# EAGLE schematic IoTKitV3-F429ZI (EAGLE 9.2.0)
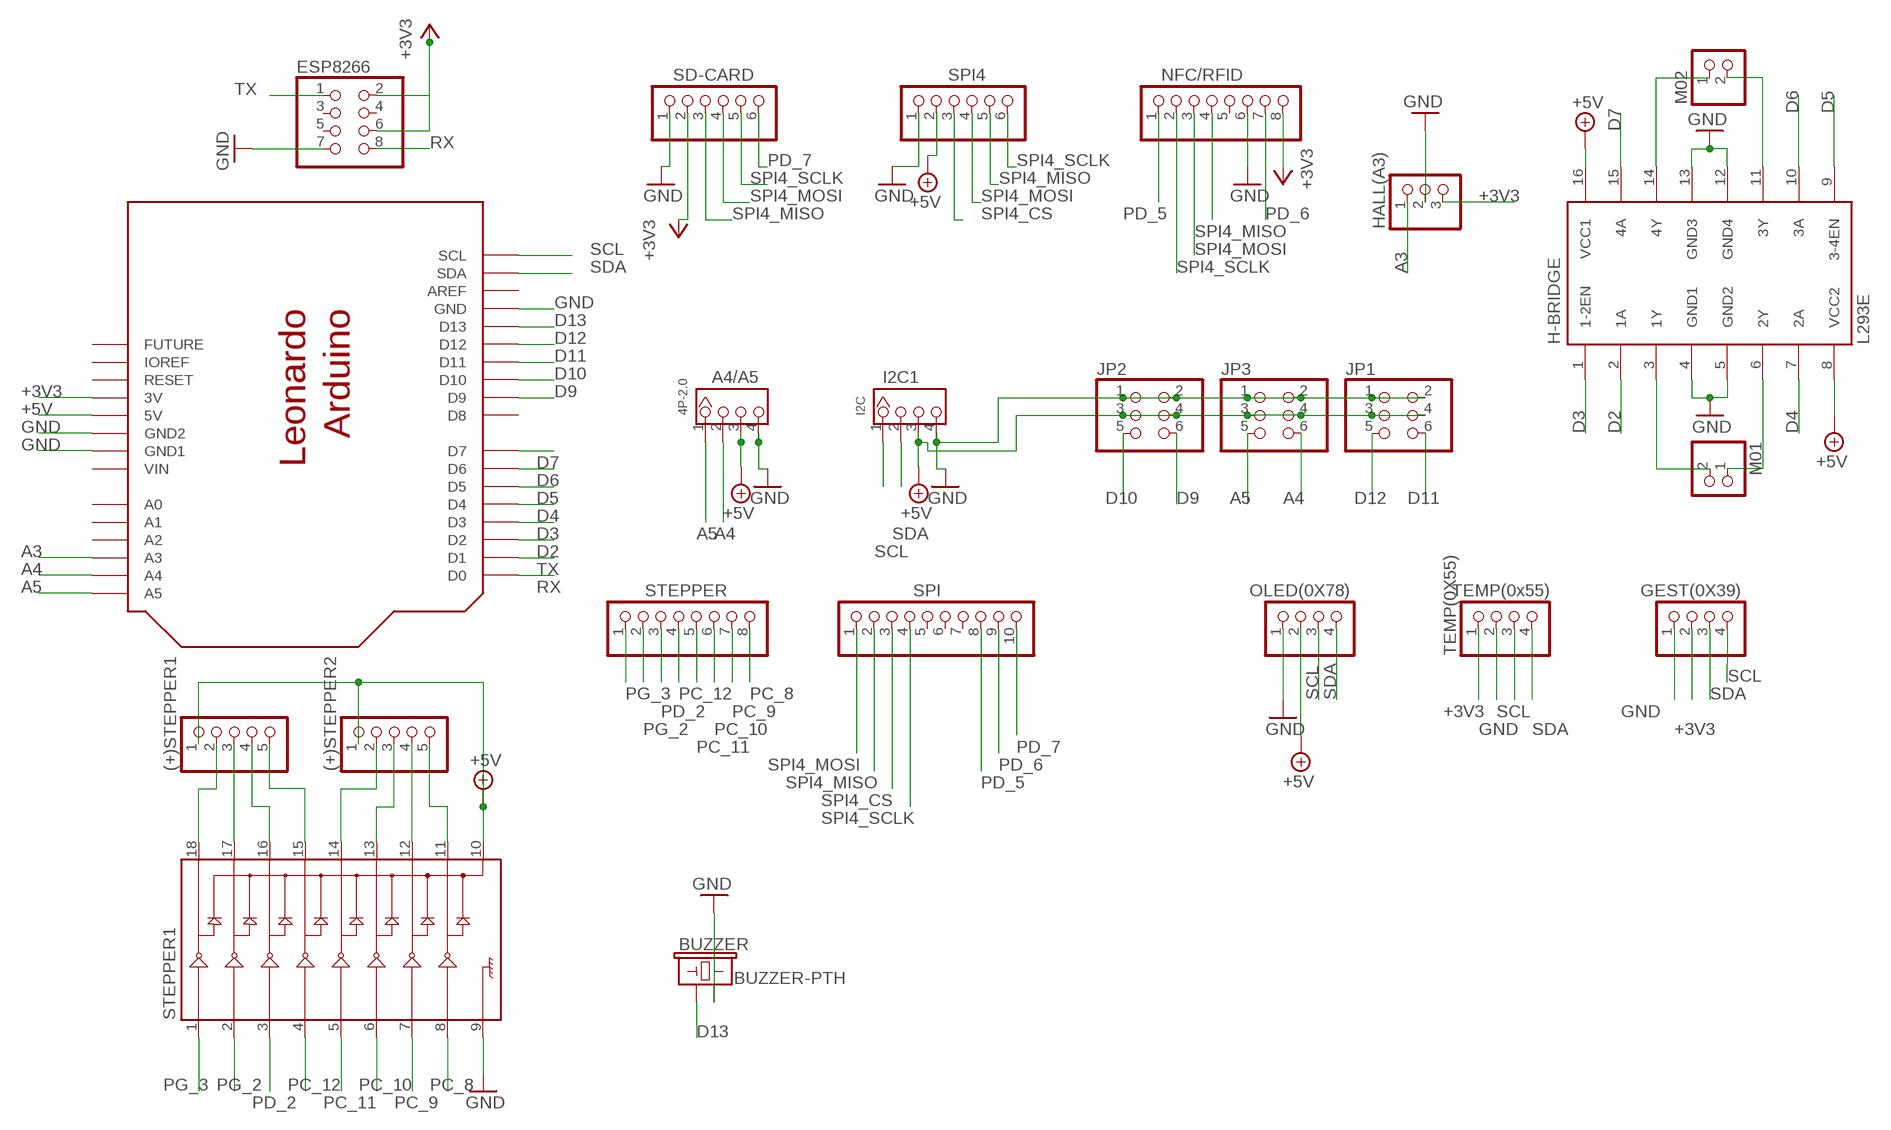
[diagram p0: schematic, sheet 1]

## Parts
(+)STEPPER1  PINHD-1X5  [1X05]
(+)STEPPER2  PINHD-1X5  [1X05]
A4/A5  4P-2.0  GROVE-CONNECTOR-DIP(4P-2.0)  [HW4-2.0]
BUZZER  BUZZER-PTH  [BUZZER-12MM]
ESP8266  PINHD-2X4  [2X04]
GEST(0X39)  PINHD-1X4  [1X04]
H-BRIDGE  L293E  [DIL16]
HALL(A3)  PINHD-1X3  [1X03]
I2C1  I2C  GROVE-CONNECTOR-DIP(4P-2.0)  [HW4-2.0]
JP1  PINHD-2X3  [2X03]
JP2  PINHD-2X3  [2X03]
JP3  PINHD-2X3  [2X03]
M01  PINHD-1X2  [1X02]
M02  PINHD-1X2  [1X02]
NFC/RFID  PINHD-1X8  [1X08]
OLED(0X78)  PINHD-1X4  [1X04]
SD-CARD  PINHD-1X6  [1X06]
SPI  PINHD-1X10  [1X10]
SPI4  PINHD-1X6  [1X06]
STEPPER  PINHD-1X8  [1X08]
STEPPER1  ULN2803DIP  [DIL18]
TEMP(0X55)  TEMP(0x55)  PINHD-1X4  [1X04]
U$1  ARDUINO_LEONARDO  [ARDUINO_LEONARDO]

## Nets
+3V3: ESP8266.2 ESP8266.6 GEST(0X39).2 HALL(A3).3 NFC/RFID.8 SD-CARD.2 TEMP(0X55).1 U$1.3V
+5V: (+)STEPPER1.1 (+)STEPPER2.1 A4/A5.3 H-BRIDGE.8(VCC2) H-BRIDGE.16(VCC1) I2C1.3 JP1.3 JP1.4 JP2.3 JP2.4 JP3.3 JP3.4 OLED(0X78).2 SPI4.2 STEPPER1.10 U$1.5V
A3: HALL(A3).1 U$1.A3
A4: A4/A5.2 JP3.6 U$1.A4
A5: A4/A5.1 JP3.5 U$1.A5
D2: H-BRIDGE.2(1A) U$1.D2
D3: H-BRIDGE.1(1-2EN) U$1.D3
D4: H-BRIDGE.7(2A) U$1.D4
D5: H-BRIDGE.9(3-4EN) U$1.D5
D6: H-BRIDGE.10(3A) U$1.D6
D7: H-BRIDGE.15(4A) U$1.D7
D9: JP2.6 U$1.D9
D10: JP2.5 U$1.D10
D11: JP1.6 U$1.D11
D12: JP1.5 U$1.D12
D13: BUZZER.+ U$1.D13
GND: A4/A5.4 BUZZER.- ESP8266.7 GEST(0X39).1 H-BRIDGE.4(GND1) H-BRIDGE.5(GND2) H-BRIDGE.12(GND4) H-BRIDGE.13(GND3) HALL(A3).2 I2C1.4 JP1.1 JP1.2 JP2.1 JP2.2 JP3.1 JP3.2 NFC/RFID.6 OLED(0X78).1 SD-CARD.1 SPI4.1 STEPPER1.9 TEMP(0X55).2 U$1.GND U$1.GND$2(GND2) U$1.GND$3(GND1)
M01: H-BRIDGE.6(2Y) M01.1
N$1: (+)STEPPER2.2 STEPPER1.14
N$2: (+)STEPPER2.3 STEPPER1.13
N$3: (+)STEPPER2.4 STEPPER1.12
N$4: (+)STEPPER2.5 STEPPER1.11
N$30: (+)STEPPER1.2 STEPPER1.18
N$31: (+)STEPPER1.3 STEPPER1.17
N$32: (+)STEPPER1.4 STEPPER1.16
N$33: (+)STEPPER1.5 STEPPER1.15
N$38: H-BRIDGE.14(4Y) M02.1
N$39: H-BRIDGE.11(3Y) M02.2
N$40: H-BRIDGE.3(1Y) M01.2
PC_8: STEPPER1.8 STEPPER.8
PC_9: STEPPER1.7 STEPPER.7
PC_10: STEPPER1.6 STEPPER.6
PC_11: STEPPER1.5 STEPPER.5
PC_12: STEPPER1.4 STEPPER.4
PD_2: STEPPER1.3 STEPPER.3
PD_5: NFC/RFID.1 SPI.8
PD_6: NFC/RFID.7 SPI.9
PD_7: SD-CARD.6 SPI.10
PG_2: STEPPER1.2 STEPPER.2
PG_3: STEPPER1.1 STEPPER.1
RX: ESP8266.8 U$1.D0
SCL: GEST(0X39).4 I2C1.1 OLED(0X78).3 TEMP(0X55).3 U$1.SCL
SDA: GEST(0X39).3 I2C1.2 OLED(0X78).4 TEMP(0X55).4 U$1.SDA
SPI4_CS: SPI4.3 SPI.3
SPI4_MISO: NFC/RFID.4 SD-CARD.3 SPI4.5 SPI.2
SPI4_MOSI: NFC/RFID.3 SD-CARD.4 SPI4.4 SPI.1
SPI4_SCLK: NFC/RFID.2 SD-CARD.5 SPI4.6 SPI.4
TX: ESP8266.1 U$1.D1
Unconnected: ESP8266.3 ESP8266.4 ESP8266.5 NFC/RFID.5 SPI.5 SPI.6 SPI.7 U$1.A0 U$1.A1 U$1.A2 U$1.AREF U$1.D8 U$1.IOREF U$1.RESERVED(FUTURE) U$1.RESET

## Power pins joined to a net without a drawn wire
VIN: U$1.VIN

## Library data of the parts
(+)STEPPER1 (+)STEPPER2 = pinhead:PINHD-1X5: PIN HEADER
A4/A5 = Seeed-Connector:GROVE-CONNECTOR-DIP(4P-2.0): 320110033
BUZZER = SparkFun-Electromechanical:BUZZER: Buzzer Small round buzzers that operate around the audible 2kHz range. You can use these as speakers to create simple music or user interfaces. Variant Overview: PTH - Mini Speaker - PC Mount 12mm 2.048kHz <https://www.sparkfun.com/products/7950> PTH_KIT - Mini Speaker - PC Mount 12mm 2.048kHz <https://www.sparkfun.com/products/7950> KIT simplifies soldering by adding stop mask to one side of the pads. PTH_NO_SILK - Mini Speaker - PC Mount 12mm 2.048kHz <https://www.sparkfun.com/products/7950> No silkscreen indicator of buzzer outline. PTH_KIT_NO_SILK - Mini Speaker - PC Mount 12mm 2.048kHz <https://www.sparkfun.com/products/7950> KIT package w/o silkscreen SMD - Buzzer Audio Magnetic (CCV-084B16) SMD buzzer used on, e.g. the LilyPad Buzzer <https://www.sparkfun.com/products/8463> and RFID USB Reader <https://www.sparkfun.com/products/9963>. SMD_KIT - Buzzer Audio Magnetic (CCV-084B16) SMD Buzzer with elongated pins to make soldering easier. Used on the SparkFun Simon Says - Surface Mount Soldering Kit <https://www.sparkfun.com/products/10935>.; PROD_ID: COMP-08253; SF_SKU: COM-07950
ESP8266 = pinhead:PINHD-2X4: PIN HEADER
GEST(0X39) OLED(0X78) TEMP(0X55) = pinhead:PINHD-1X4: PIN HEADER
H-BRIDGE = texas:L293E: TI DEVICE; MF: Arrow Electronics; MPN: L293E; OC_FARNELL: 1467711; OC_NEWARK: 89K0732
HALL(A3) = pinhead:PINHD-1X3: PIN HEADER
I2C1 = Seeed-Connector:GROVE-CONNECTOR-DIP(4P-2.0): 320110033; VALUE: 4P-2.0
JP1-JP3 = pinhead:PINHD-2X3: PIN HEADER
M01 M02 = pinhead:PINHD-1X2: PIN HEADER
NFC/RFID STEPPER = pinhead:PINHD-1X8: PIN HEADER
SD-CARD SPI4 = pinhead:PINHD-1X6: PIN HEADER
SPI = pinhead:PINHD-1X10: PIN HEADER
STEPPER1 = SparkFun-IC-Special-Function:ULN2803: Darlington Driver(IC-07959, low stock) ULN2803 Darlington array. 500mA max per channel, 8-channel package. Spark Fun Electronics SKU : COM-00312
U$1 = srg:ARDUINO_LEONARDO: Arduino Leonardo I2C Pins: D2, D3 PWM Pins: D3, D5, D5, D11, D13 Interrup Pint: D2, D3 http://arduino.cc/en/Main/arduinoBoardLeonardo